# EAGLE design camSplit (EAGLE 5.10)
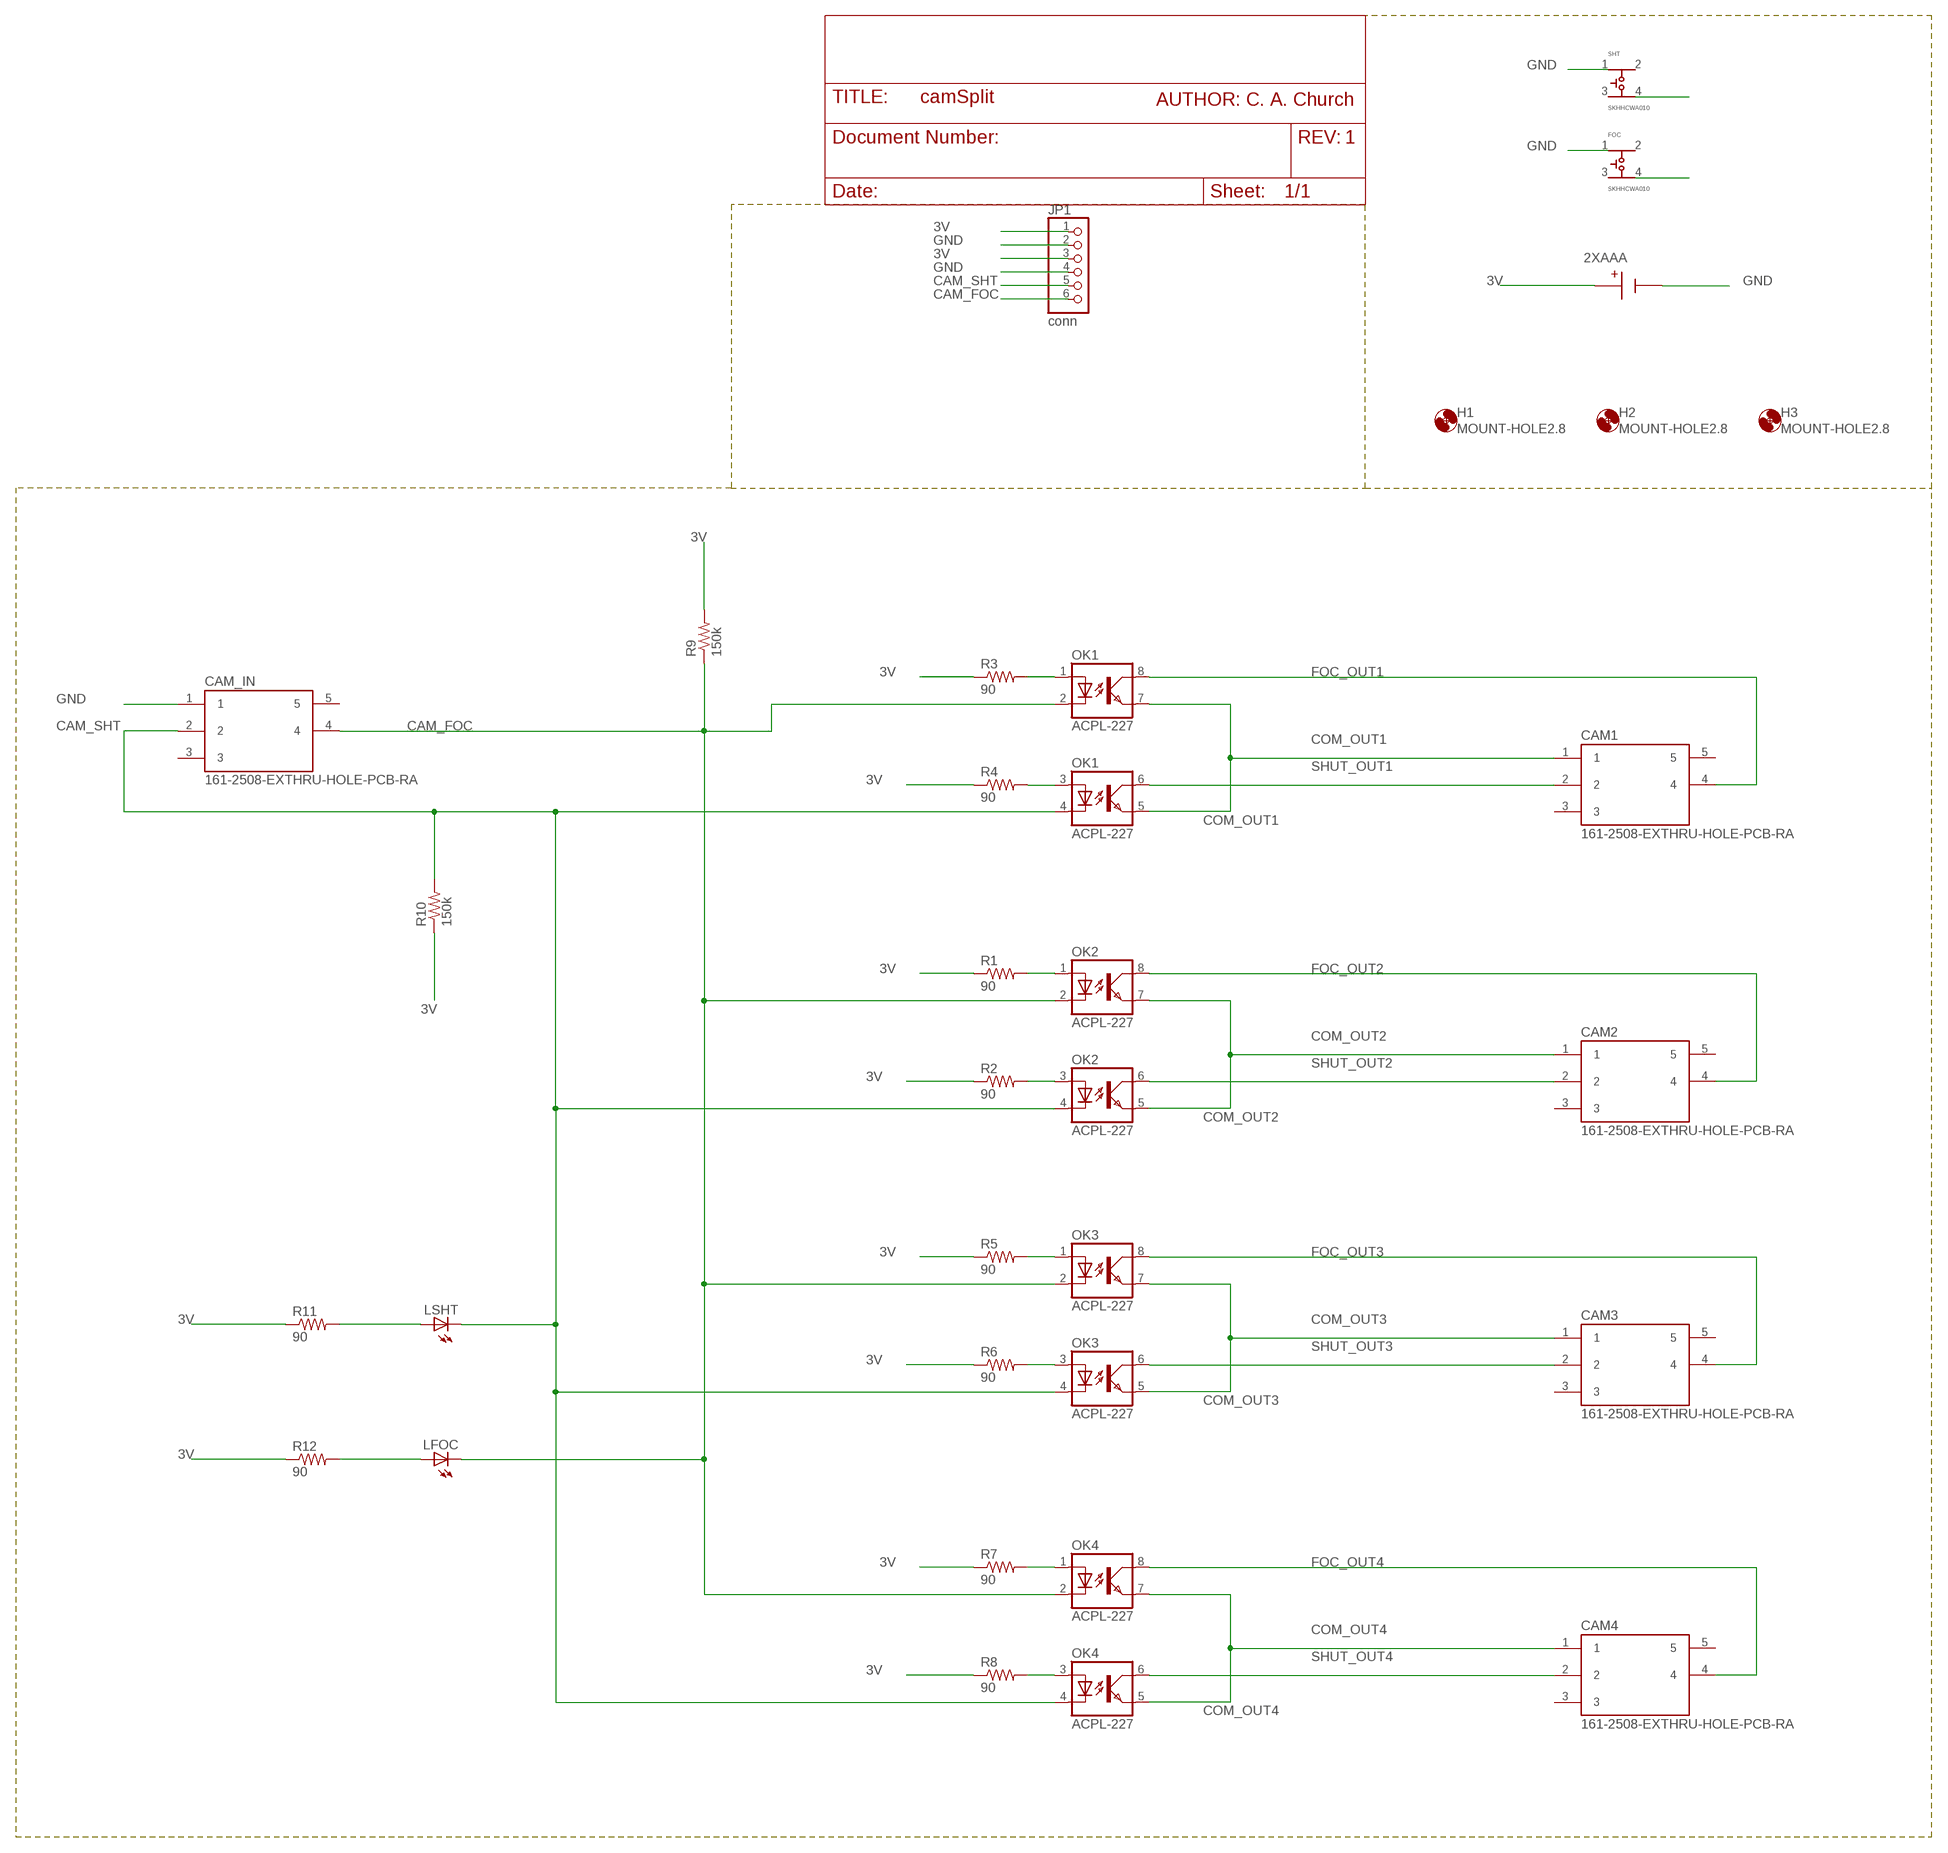
[diagram p0: schematic, sheet 1]

## Parts
2XAAA  12BH423-GR  [12BH423-GR]
CAM1  161-2508-EXTHRU-HOLE-PCB-RA  [PCB-HORIZ]
CAM2  161-2508-EXTHRU-HOLE-PCB-RA  [PCB-HORIZ]
CAM3  161-2508-EXTHRU-HOLE-PCB-RA  [PCB-HORIZ]
CAM4  161-2508-EXTHRU-HOLE-PCB-RA  [PCB-HORIZ]
CAM_IN  161-2508-EXTHRU-HOLE-PCB-RA  [PCB-HORIZ]
FOC  SKHHCWA010  SKHH  [SKHH]
H1  MOUNT-HOLE2.8  [2,8]
H2  MOUNT-HOLE2.8  [2,8]
H3  MOUNT-HOLE2.8  [2,8]
JP1  conn  PINHD-1X6  [1X06]
LFOC  LED3MM  [LED3MM]
LSHT  LED3MM  [LED3MM]
OK1  ACPL-227  [SOIC8]
OK2  ACPL-227  [SOIC8]
OK3  ACPL-227  [SOIC8]
OK4  ACPL-227  [SOIC8]
R1  90  R-US_R0402  [R0402]
R2  90  R-US_R0402  [R0402]
R3  90  R-US_R0402  [R0402]
R4  90  R-US_R0402  [R0402]
R5  90  R-US_R0402  [R0402]
R6  90  R-US_R0402  [R0402]
R7  90  R-US_R0402  [R0402]
R8  90  R-US_R0402  [R0402]
R9  150k  R-US_R0402  [R0402]
R10  150k  R-US_R0402  [R0402]
R11  90  R-US_R0402  [R0402]
R12  90  R-US_R0402  [R0402]
SHT  SKHHCWA010  SKHH  [SKHH]

## Nets
3V: 2XAAA.POS(+V) JP1.1 JP1.3 R1.1 R2.1 R3.1 R4.1 R5.1 R6.1 R7.1 R8.1 R9.2 R10.1 R11.1 R12.1
CAM_FOC: CAM_IN.4 FOC.4 JP1.6 LFOC.K(C) OK1.2(C) OK2.2(C) OK3.2(C) OK4.2(C) R9.1
CAM_SHT: CAM_IN.2 JP1.5 LSHT.K(C) OK1.4(C1) OK2.4(C1) OK3.4(C1) OK4.4(C1) R10.2 SHT.4
COM_OUT1: CAM1.1 OK1.5(EMIT1) OK1.7(EMIT)
COM_OUT2: CAM2.1 OK2.5(EMIT1) OK2.7(EMIT)
COM_OUT3: CAM3.1 OK3.5(EMIT1) OK3.7(EMIT)
COM_OUT4: CAM4.1 OK4.5(EMIT1) OK4.7(EMIT)
FOC_OUT1: CAM1.4 OK1.8(COL)
FOC_OUT2: CAM2.4 OK2.8(COL)
FOC_OUT3: CAM3.4 OK3.8(COL)
FOC_OUT4: CAM4.4 OK4.8(COL)
GND: 2XAAA.NEG(-V) CAM_IN.1 FOC.1 JP1.2 JP1.4 SHT.1
N$1: OK1.1(A) R3.2
N$2: OK2.1(A) R1.2
N$3: OK1.3(A1) R4.2
N$4: OK2.3(A1) R2.2
N$5: OK3.1(A) R5.2
N$6: OK3.3(A1) R6.2
N$7: OK4.1(A) R7.2
N$8: OK4.3(A1) R8.2
N$9: LSHT.A R11.2
N$13: LFOC.A R12.2
SHUT_OUT1: CAM1.2 OK1.6(COL1)
SHUT_OUT2: CAM2.2 OK2.6(COL1)
SHUT_OUT3: CAM3.2 OK3.6(COL1)
SHUT_OUT4: CAM4.2 OK4.6(COL1)
Unconnected: CAM1.3 CAM1.5 CAM2.3 CAM2.5 CAM3.3 CAM3.5 CAM4.3 CAM4.5 CAM_IN.3 CAM_IN.5 FOC.2 FOC.3 SHT.2 SHT.3

## Notes on the sheet
- AUTHOR: C. A. Church
- 1

## Library data of the parts
2XAAA = eagle-plastic-devices:12BH423-GR
CAM1-CAM4 CAM_IN = kobiconn-161-2508-ex:161-2508-EX
FOC SHT = alps:SKHH: SKHH* vertical/joint stem momentary pushbutton PCB mount switch
H1-H3 = holes:MOUNT-HOLE: MOUNTING HOLE with drill center marker
JP1 = pinhead:PINHD-1X6: PIN HEADER
LFOC LSHT = SparkFun:LED: LEDs Standard schematic elements and footprints for 5mm, 3mm, 1206, and 0603 sized LEDs. 5mm - Spark Fun Electronics SKU : COM-00529 (and others)
OK1-OK4 = avago-opto:ACPL-227: ACPL-227 Dual optocoupler SOIC8
R1-R12 = resistor:R-US_: RESISTOR, American symbol

## Board
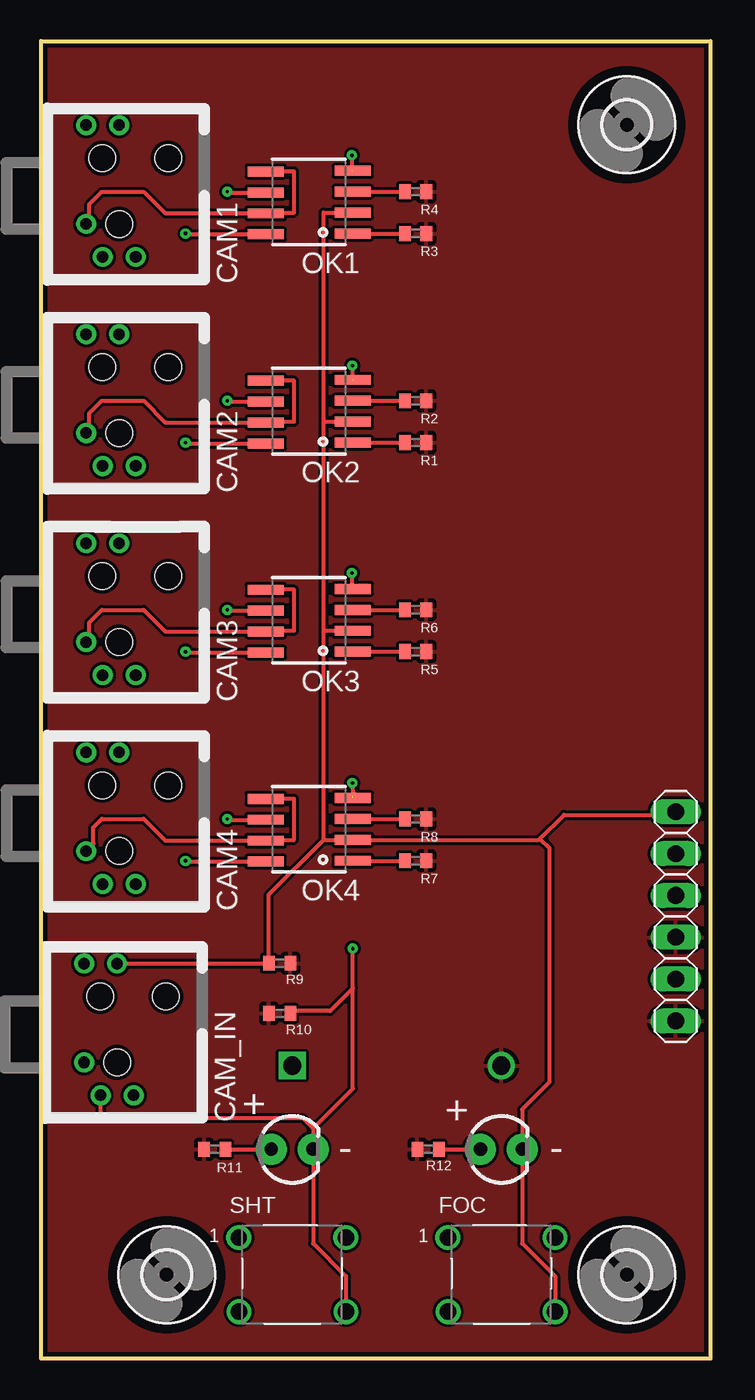
[diagram p1: board, top side]
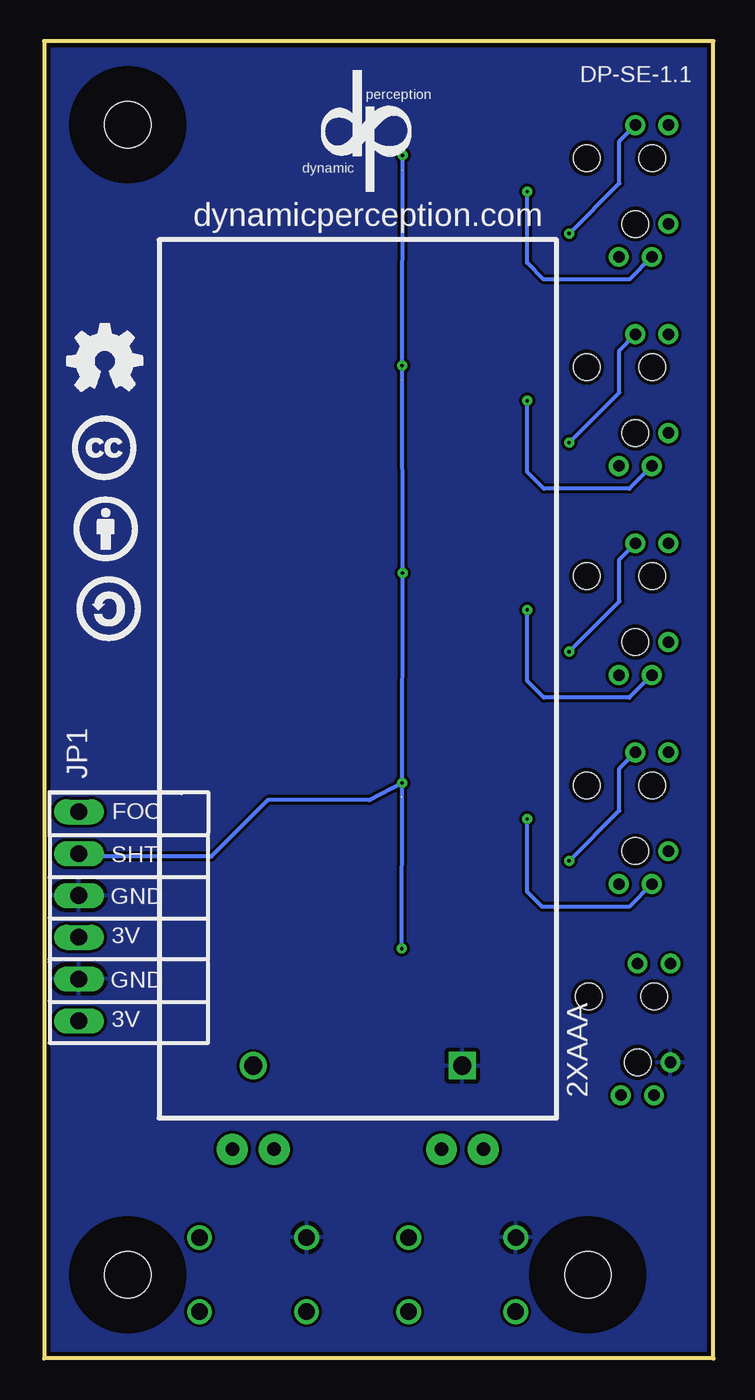
[diagram p2: board, bottom side, seen from below]

Size 40.64 x 80.01 mm. Coordinates in mm from the lower left corner, seen from the top.
Outline: 0,0 40.64,0 40.64,80.01 0,80.01 0,0
Copper layers (1*16): Top 0.035mm / dielectric 1.5mm / Bottom 0.035mm
Design rules: minimum track width 7mil, minimum drill 7mil, track to track 7mil, track to pad 7mil, pad to pad 8mil, via to via 8mil, smd to smd 7mil, copper to edge 10mil, drill to drill 7mil, minimum pad ring 10mil, minimum via ring 8mil, stop-mask expansion 4mil, vias tented up to drill 10mil, thermal gap 10mil

### Footprints (pad centres in the part's own frame; a part is rotated, then mirrored left to right if it is on the bottom)
12BH423-GR = drill 1.1 square: NEG 22.86,6.35 | drill 1.1: POS 22.86,-6.35
PCB-HORIZ = drill 0.7: 1 -1.96,-0.32; 2 -3.96,-1.32; 3 -3.96,-3.33; 4 4.04,-2.32; 5 4.04,-0.32 | hole 1.6: 2.04,-1.29; 2.04,-5.29; -1.96,-2.32
SKHH = drill 1: 1 -3.242,2.261; 2 3.264,2.262; 3 -3.23,-2.242; 4 3.267,-2.245
2,8 = hole 2.8: 0,0
1X06 = drill 1.016 long: 1 -6.35,0; 2 -3.81,0; 3 -1.27,0; 4 1.27,0; 5 3.81,0; 6 6.35,0
LED3MM = drill 0.813 pad 1.88: A -1.27,0; K 1.27,0
SOIC8 = smd 2.2 x 0.6: 1 0,3.81; 2 0,2.54; 3 0,1.27; 4 0,0; 5 5.28,0.05; 6 5.28,1.32; 7 5.28,2.59; 8 5.28,3.86
R0402 = smd 0.7 x 0.9: 1 -0.65,0; 2 0.65,0

### Placement (x,y rotation side)
2XAAA  21.59,40.64 270 bottom
CAM1  2.41,70.87 90 top
CAM2  2.41,58.17 90 top
CAM3  2.41,45.47 90 top
CAM4  2.41,32.77 90 top
CAM_IN  2.29,19.94 90 top
FOC  27.94,5.08 0 top
H1  35.56,74.93 0 top
H2  35.56,5.08 0 top
H3  7.62,5.08 0 top
JP1  38.53,26.85 90 top
LFOC  27.94,12.7 0 top
LSHT  15.24,12.7 0 top
OK1  18.92,72.14 180 top
OK2  18.92,59.44 180 top
OK3  18.92,46.74 180 top
OK4  18.92,34.04 180 top
R1  22.73,55.63 180 top
R2  22.73,58.17 180 top
R3  22.73,68.33 180 top
R4  22.73,70.87 180 top
R5  22.73,42.93 180 top
R6  22.73,45.47 180 top
R7  22.73,30.23 180 top
R8  22.73,32.77 180 top
R9  14.48,24 0 top
R10  14.48,20.95 0 top
R11  10.54,12.7 0 top
R12  23.5,12.7 0 top
SHT  15.24,5.08 0 top

### Tracks (layer width: path | path; a pad name or v marks a point on that pad's centre or on a via)
3V
  pour Top: 0,80.01 40.64,80.01 40.64,0 0,0
CAM_FOC
  Top 0.254: CAM_IN.4 13.83,23.98 R9.1 13.83,28.18 17.14,31.5 | 17.14,31.5 OK4.2 30.23,31.5 30.29,31.56 | 17.14,31.5 17.14,44.2 | 17.14,44.2 OK3.2 | 17.14,56.9 OK2.2 | 17.14,44.2 17.14,56.9 | OK1.2 17.14,69.6 17.14,56.9 | 30.29,31.56 31.75,33.02 38.35,33.02 JP1.6 | FOC.4 31.21,4.99 29.21,6.99 LFOC.K 29.21,15.11 30.86,16.76 30.86,30.99 30.29,31.56
CAM_SHT  (via drill 0.2)  (3 unrouted)
  Top 0.254: v18.9,60.3 18.9,59.36 18.92,59.41 | v18.87,73.08 18.87,72.19 18.9,72.19 | v18.9,34.95 18.92,34.16 19.05,34.29 | SHT.4 18.51,4.99 16.51,6.99 LSHT.K 16.51,13.97 | CAM_IN.2 3.61,14.94 3.94,14.61 15.88,14.61 16.51,13.97 | R10.2 15.13,21.1 17.54,21.1 18.92,22.48 | 18.92,22.48 18.92,16.38 16.51,13.97 | 18.92,22.48 v18.92,24.89 | v18.87,47.7 18.85,46.76 OK3.4
  Bottom 0.254: v18.87,73.08 v18.9,60.3 v18.87,47.7 v18.9,34.95 | v18.9,34.95 20.88,33.91 27.05,33.91 30.48,30.48 38.35,30.48 JP1.5 | v18.92,24.89 v18.9,34.95
COM_OUT1
  Top 0.254: OK1.5 15.37,72.09 15.37,69.6 13.64,69.6 OK1.7 7.54,69.55 6.22,70.87 3.68,70.87 2.92,70.1 2.92,69.09 CAM1.1
COM_OUT2
  Top 0.254: OK2.5 15.37,59.39 15.37,56.9 13.64,56.9 OK2.7 7.54,56.85 6.22,58.17 3.68,58.17 2.92,57.4 2.92,56.39 CAM2.1
COM_OUT3
  Top 0.254: OK3.5 15.37,46.69 15.37,44.2 13.64,44.2 OK3.7 7.54,44.15 6.22,45.47 3.68,45.47 2.92,44.7 2.92,43.69 CAM3.1
COM_OUT4
  Top 0.254: OK4.5 15.37,33.99 15.37,31.5 13.64,31.5 OK4.7 7.54,31.45 6.22,32.77 3.68,32.77 3.17,32.26 3.17,31.25 CAM4.1
FOC_OUT1  (via drill 0.2)
  Top 0.254: OK1.8 8.81,68.28 v8.76,68.33
  Bottom 0.254: v8.76,68.33 5.71,71.37 5.71,73.92 CAM1.4
FOC_OUT2  (via drill 0.2)
  Top 0.254: OK2.8 8.81,55.58 v8.76,55.63
  Bottom 0.254: v8.76,55.63 5.71,58.67 5.71,61.22 CAM2.4
FOC_OUT3  (via drill 0.2)
  Top 0.254: OK3.8 8.81,42.88 v8.76,42.93
  Bottom 0.254: v8.76,42.93 5.71,45.97 5.71,48.52 CAM3.4
FOC_OUT4  (via drill 0.2)
  Top 0.254: OK4.8 8.81,30.18 v8.76,30.23
  Bottom 0.254: v8.76,30.23 5.71,33.27 5.71,35.82 CAM4.4
GND
  pour Bottom: -0.13,80.01 40.77,80.01 40.64,0 0,0.25
N$1
  Top 0.254: OK1.1 R3.2
N$2
  Top 0.254: OK2.1 R1.2
N$3
  Top 0.254: OK1.3 R4.2
N$4
  Top 0.254: OK2.3 R2.2
N$5
  Top 0.254: OK3.1 R5.2
N$6
  Top 0.254: OK3.3 R6.2
N$7
  Top 0.254: OK4.1 R7.2
N$8
  Top 0.254: OK4.3 R8.2
N$9
  Top 0.254: R11.2 LSHT.A
N$13
  Top 0.254: R12.2 LFOC.A
SHUT_OUT1  (via drill 0.2)
  Top 0.254: OK1.6 11.35,70.82 v11.3,70.87
  Bottom 0.254: v11.3,70.87 11.3,66.55 10.29,65.53 5.11,65.53 CAM1.2
SHUT_OUT2  (via drill 0.2)
  Top 0.254: OK2.6 11.35,58.12 v11.3,58.17
  Bottom 0.254: v11.3,58.17 11.3,53.85 10.29,52.83 5.11,52.83 CAM2.2
SHUT_OUT3  (via drill 0.2)
  Top 0.254: OK3.6 11.35,45.42 v11.3,45.47
  Bottom 0.254: v11.3,45.47 11.3,41.15 10.29,40.13 5.11,40.13 CAM3.2
SHUT_OUT4  (via drill 0.2)
  Top 0.254: OK4.6 11.35,32.72 v11.3,32.77
  Bottom 0.254: CAM4.2 5.11,27.43 10.4,27.43 11.3,28.33 v11.3,32.77

### Text on the board
tNames: + | + | - | -
bNames: DP-SE-1.1 | perception | dynamic | dynamicperception.com | FOC | SHT | GND | 3V | GND | 3V